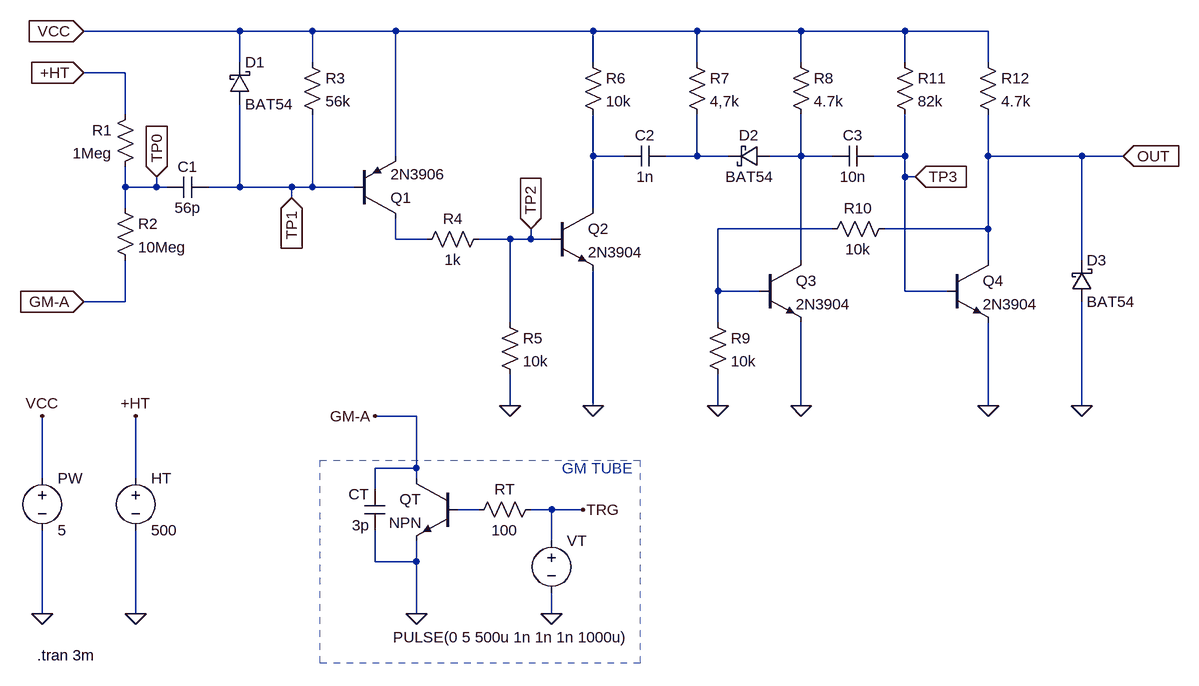
[diagram p0: schematic GM PULSE AMPLIFIER.asc]
GM PULSE AMPLIFIER.asc, the LTspice schematic file:
Version 4
SHEET 1 1940 1120
WIRE 368 64 128 64
WIRE 480 64 368 64
WIRE 608 64 480 64
WIRE 912 64 608 64
WIRE 1072 64 912 64
WIRE 1232 64 1072 64
WIRE 1392 64 1232 64
WIRE 1520 64 1392 64
WIRE 368 112 368 64
WIRE 480 112 480 64
WIRE 912 112 912 64
WIRE 1072 112 1072 64
WIRE 1232 112 1232 64
WIRE 1392 112 1392 64
WIRE 1520 112 1520 64
WIRE 192 128 128 128
WIRE 192 192 192 128
WIRE 608 256 608 64
WIRE 912 256 912 192
WIRE 960 256 912 256
WIRE 1072 256 1072 192
WIRE 1072 256 1024 256
WIRE 1120 256 1072 256
WIRE 1232 256 1232 192
WIRE 1232 256 1184 256
WIRE 1280 256 1232 256
WIRE 1392 256 1392 192
WIRE 1392 256 1344 256
WIRE 1520 256 1520 192
WIRE 1664 256 1520 256
WIRE 1728 256 1664 256
WIRE 1392 288 1392 256
WIRE 1408 288 1392 288
WIRE 192 304 192 272
WIRE 240 304 240 288
WIRE 240 304 192 304
WIRE 256 304 240 304
WIRE 368 304 368 176
WIRE 368 304 320 304
WIRE 448 304 368 304
WIRE 480 304 480 192
WIRE 480 304 448 304
WIRE 544 304 480 304
WIRE 448 320 448 304
WIRE 192 336 192 304
WIRE 912 336 912 256
WIRE 1280 368 1104 368
WIRE 1520 368 1520 256
WIRE 1520 368 1360 368
WIRE 608 384 608 352
WIRE 656 384 608 384
WIRE 784 384 736 384
WIRE 816 384 816 368
WIRE 816 384 784 384
WIRE 848 384 816 384
WIRE 1232 416 1232 256
WIRE 1520 416 1520 368
WIRE 1664 416 1664 256
WIRE 1104 464 1104 368
WIRE 1168 464 1104 464
WIRE 1392 464 1392 288
WIRE 1456 464 1392 464
WIRE 192 480 192 416
WIRE 192 480 128 480
WIRE 784 512 784 384
WIRE 1104 512 1104 464
WIRE 784 640 784 592
WIRE 912 640 912 432
WIRE 1104 640 1104 592
WIRE 1232 640 1232 512
WIRE 1520 640 1520 512
WIRE 1664 640 1664 480
WIRE 640 656 576 656
WIRE 640 736 640 656
WIRE 640 736 576 736
WIRE 64 752 64 656
WIRE 208 752 208 656
WIRE 640 752 640 736
WIRE 576 768 576 736
WIRE 736 800 704 800
WIRE 848 800 816 800
WIRE 896 800 848 800
WIRE 848 848 848 800
WIRE 576 880 576 832
WIRE 640 880 640 848
WIRE 640 880 576 880
WIRE 64 960 64 832
WIRE 208 960 208 832
WIRE 640 960 640 880
WIRE 848 960 848 928
FLAG 128 128 +HT
IOPIN 128 128 In
FLAG 128 480 GM-A
IOPIN 128 480 In
FLAG 128 64 VCC
IOPIN 128 64 In
FLAG 640 960 0
FLAG 848 960 0
FLAG 896 800 TRG
FLAG 208 960 0
FLAG 64 960 0
FLAG 208 656 +HT
FLAG 64 656 VCC
FLAG 576 656 GM-A
FLAG 448 320 TP1
IOPIN 448 320 In
FLAG 784 640 0
FLAG 912 640 0
FLAG 1232 640 0
FLAG 1104 640 0
FLAG 1520 640 0
FLAG 1728 256 OUT
IOPIN 1728 256 In
FLAG 816 368 TP2
IOPIN 816 368 In
FLAG 1408 288 TP3
IOPIN 1408 288 In
FLAG 240 288 TP0
IOPIN 240 288 In
FLAG 1664 640 0
SYMBOL res 208 176 M0
SYMATTR InstName R1
SYMATTR Value 1Meg
SYMBOL res 176 320 R0
SYMATTR InstName R2
SYMATTR Value 10Meg
SYMBOL cap 320 288 R90
WINDOW 0 0 32 VBottom 2
WINDOW 3 32 32 VTop 2
SYMATTR InstName C1
SYMATTR Value 56p
SYMBOL res 464 96 R0
SYMATTR InstName R3
SYMATTR Value 56k
SYMBOL pnp 544 352 M180
SYMATTR InstName Q1
SYMATTR Value 2N3906
SYMBOL voltage 848 832 R0
WINDOW 3 -244 164 Left 2
SYMATTR Value PULSE(0 5 500u 1n 1n 1n 1000u)
SYMATTR InstName VT
SYMBOL res 832 784 R90
WINDOW 0 0 56 VBottom 2
WINDOW 3 32 56 VTop 2
SYMATTR InstName RT
SYMATTR Value 100
SYMBOL npn 704 752 M0
SYMATTR InstName QT
SYMBOL voltage 208 736 R0
SYMATTR InstName HT
SYMATTR Value 500
SYMBOL voltage 64 736 R0
SYMATTR InstName PW
SYMATTR Value 5
SYMBOL cap 592 768 M0
SYMATTR InstName CT
SYMATTR Value 3p
SYMBOL schottky 352 176 M180
WINDOW 0 24 64 Left 2
WINDOW 3 24 0 Left 2
SYMATTR InstName D1
SYMATTR Value BAT54
SYMATTR Description Diode
SYMATTR Type diode
SYMBOL res 752 368 R90
WINDOW 0 0 56 VBottom 2
WINDOW 3 32 56 VTop 2
SYMATTR InstName R4
SYMATTR Value 1k
SYMBOL res 768 496 R0
SYMATTR InstName R5
SYMATTR Value 10k
SYMBOL npn 848 336 R0
SYMATTR InstName Q2
SYMATTR Value 2N3904
SYMBOL res 896 96 R0
SYMATTR InstName R6
SYMATTR Value 10k
SYMBOL cap 1024 240 R90
WINDOW 0 0 32 VBottom 2
WINDOW 3 32 32 VTop 2
SYMATTR InstName C2
SYMATTR Value 1n
SYMBOL res 1056 96 R0
SYMATTR InstName R7
SYMATTR Value 4,7k
SYMBOL schottky 1184 240 R90
WINDOW 0 0 32 VBottom 2
WINDOW 3 32 32 VTop 2
SYMATTR InstName D2
SYMATTR Value BAT54
SYMATTR Description Diode
SYMATTR Type diode
SYMBOL res 1216 96 R0
SYMATTR InstName R8
SYMATTR Value 4.7k
SYMBOL npn 1168 416 R0
SYMATTR InstName Q3
SYMATTR Value 2N3904
SYMBOL cap 1344 240 R90
WINDOW 0 0 32 VBottom 2
WINDOW 3 32 32 VTop 2
SYMATTR InstName C3
SYMATTR Value 10n
SYMBOL res 1376 96 R0
SYMATTR InstName R11
SYMATTR Value 82k
SYMBOL res 1088 496 R0
SYMATTR InstName R9
SYMATTR Value 10k
SYMBOL res 1376 352 R90
WINDOW 0 0 56 VBottom 2
WINDOW 3 32 56 VTop 2
SYMATTR InstName R10
SYMATTR Value 10k
SYMBOL npn 1456 416 R0
SYMATTR InstName Q4
SYMATTR Value 2N3904
SYMBOL res 1504 96 R0
SYMATTR InstName R12
SYMATTR Value 4.7k
SYMBOL schottky 1648 480 M180
WINDOW 0 24 64 Left 2
WINDOW 3 24 0 Left 2
SYMATTR InstName D3
SYMATTR Value BAT54
SYMATTR Description Diode
SYMATTR Type diode
TEXT 56 1024 Left 2 !.tran 3m
TEXT 864 736 Left 2 ;GM TUBE
RECTANGLE Normal 492 724 984 1036 2

The netlist it stands for:
* GM PULSE AMPLIFIER.asc
R1 +HT TP0 1Meg
R2 TP0 GM-A 10Meg
C1 TP1 TP0 56p
R3 VCC TP1 56k
Q1 N005 TP1 VCC 0 2N3906
VT TRG 0 PULSE(0 5 500u 1n 1n 1n 1000u)
RT TRG N006 100
QT GM-A N006 0 0 NPN
V§HT +HT 0 500
V§PW VCC 0 5
CT GM-A 0 3p
D1 TP1 VCC BAT54
R4 TP2 N005 1k
R5 TP2 0 10k
Q2 N001 TP2 0 0 2N3904
R6 VCC N001 10k
C2 N002 N001 1n
R7 VCC N002 4,7k
D2 N003 N002 BAT54
R8 VCC N003 4.7k
Q3 N003 N004 0 0 2N3904
C3 TP3 N003 10n
R11 VCC TP3 82k
R9 N004 0 10k
R10 OUT N004 10k
Q4 OUT TP3 0 0 2N3904
R12 VCC OUT 4.7k
D3 0 OUT BAT54
.model D D
.lib standard.dio
.model NPN NPN
.model PNP PNP
.lib standard.bjt
.tran 3m
* GM TUBE
.backanno
.end